# Altium project NFC_Access.PrjPcb
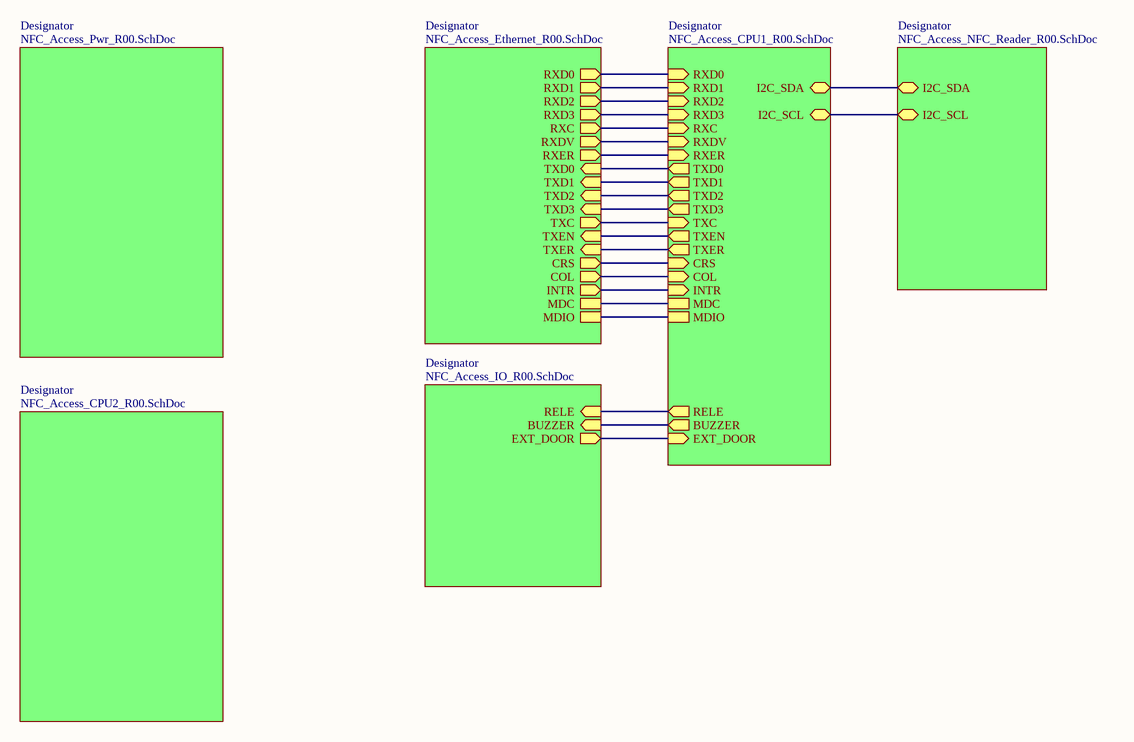
[diagram p0: NFC_Access_MainPage_R00.SchDoc]
7 sheets, 109 parts. Net scope: hierarchical (ports join the sheet entries above them; power ports are global).
Board files: NFC_Access_R00.PcbDoc, NFC_Access_Panel_R00.PcbDoc
Sheets:
  NFC_Access_MainPage_R00.SchDoc
    Designator = NFC_Access_CPU1_R00.SchDoc
    Designator = NFC_Access_Ethernet_R00.SchDoc
    Designator = NFC_Access_NFC_Reader_R00.SchDoc
    Designator = NFC_Access_IO_R00.SchDoc
    Designator = NFC_Access_Pwr_R00.SchDoc
    Designator = NFC_Access_CPU2_R00.SchDoc

## Sheet NFC_Access_MainPage_R00.SchDoc: NFC Access Board
size A4; Author: Hernan M. Travado; CompanyName: UTN FRBA; DocumentNumber: 1.0; SheetNumber: 1; SheetTotal: 7

### Sub-sheets
Designator = NFC_Access_CPU1_R00.SchDoc: CRS (in), COL (in), RXC (in), MDIO, RXDV (in), RXD2 (in), RXD3 (in), RXER (in), TXEN (out), TXD0 (out), TXD1 (out), RXD0 (in), MDC, TXC (in), TXD2 (out), RXD1 (in), TXD3 (out), INTR (in), TXER (out), RELE (out), EXT_DOOR (in), BUZZER (out), I2C_SCL (bidir), I2C_SDA (bidir)
Designator = NFC_Access_Ethernet_R00.SchDoc: RXD1 (out), RXD2 (out), RXD3 (out), RXD0 (out), RXC (out), RXDV (out), RXER (out), TXD1 (in), TXD2 (in), TXD3 (in), TXD0 (in), COL (out), CRS (out), TXC (out), TXEN (in), TXER (in), INTR (out), MDC, MDIO
Designator = NFC_Access_NFC_Reader_R00.SchDoc: I2C_SDA (bidir), I2C_SCL (bidir)
Designator = NFC_Access_IO_R00.SchDoc: RELE (in), BUZZER (in), EXT_DOOR (out)
Designator = NFC_Access_Pwr_R00.SchDoc: no entries
Designator = NFC_Access_CPU2_R00.SchDoc: no entries

### Nets
BUZZER: sheet Designator/BUZZER, sheet Designator/BUZZER
I2C_SCL: sheet Designator/I2C_SCL, sheet Designator/I2C_SCL
I2C_SDA: sheet Designator/I2C_SDA, sheet Designator/I2C_SDA
INTR: sheet Designator/INTR, sheet Designator/INTR
MDC: sheet Designator/MDC, sheet Designator/MDC
MDIO: sheet Designator/MDIO, sheet Designator/MDIO
RELE: sheet Designator/RELE, sheet Designator/RELE
TXEN: sheet Designator/TXEN, sheet Designator/TXEN
TXER: sheet Designator/TXER, sheet Designator/TXER
NetCN4_2: sheet Designator/EXT_DOOR, sheet Designator/EXT_DOOR
NetR8_2: sheet Designator/CRS, sheet Designator/CRS
NetR9_2: sheet Designator/TXC, sheet Designator/TXC
NetR10_2: sheet Designator/COL, sheet Designator/COL
NetR15_2: sheet Designator/RXD0, sheet Designator/RXD0
NetR16_2: sheet Designator/RXER, sheet Designator/RXER
NetR17_2: sheet Designator/RXD1, sheet Designator/RXD1
NetR18_2: sheet Designator/RXC, sheet Designator/RXC
NetR19_2: sheet Designator/RXD2, sheet Designator/RXD2
NetR20_2: sheet Designator/RXDV, sheet Designator/RXDV
NetR21_2: sheet Designator/RXD3, sheet Designator/RXD3
NetU4_24: sheet Designator/TXD0, sheet Designator/TXD0
NetU4_25: sheet Designator/TXD1, sheet Designator/TXD1
NetU4_26: sheet Designator/TXD2, sheet Designator/TXD2
NetU4_27: sheet Designator/TXD3, sheet Designator/TXD3

### Notes on the sheet
- Title:
- Size:
- Author:
- A4
- Sheet
- of
- Revision:
- File:
- Date:

## Sheet NFC_Access_CPU1_R00.SchDoc: NFC Access Board
size A4; Author: Hernan M. Travado; CompanyName: UTN FRBA; Revision: 1.0; SheetNumber: 5; SheetTotal: 7
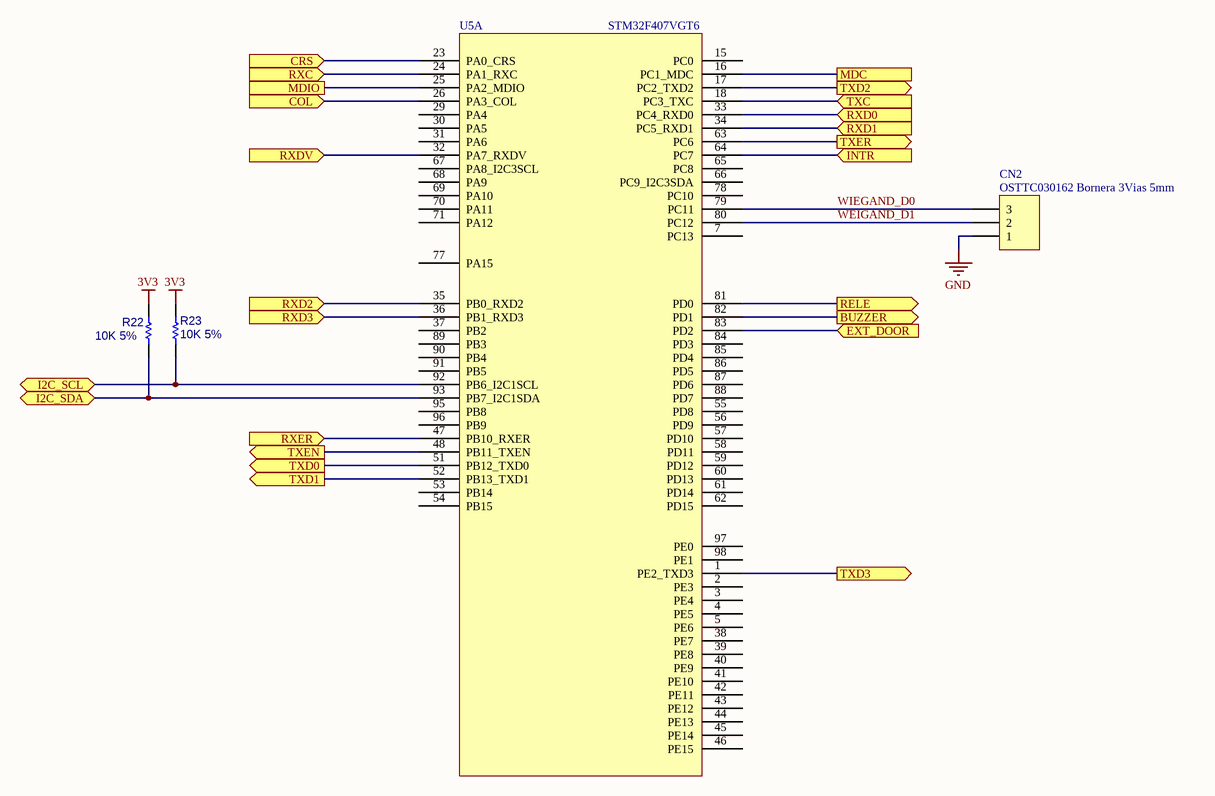
[diagram p1: NFC_Access_CPU1_R00.SchDoc]

### Parts
CN2  OSTTC030162 Bornera 3Vias 5mm  [TerminalBlock_1x3_P5mm]
R22  10K 5%  [R_0603]
R23  10K 5%  [R_0603]
U5  STM32F407VGT6  [LQFP100]  (part A of 2)

### Ports
BUZZER (out, see NFC_Access_MainPage_R00[3C], NFC_Access_IO_R00[1B]), COL (in, see NFC_Access_MainPage_R00[3B], NFC_Access_Ethernet_R00[3A]), CRS (in, see NFC_Access_MainPage_R00[3B], NFC_Access_Ethernet_R00[3A]), EXT_DOOR (in, see NFC_Access_MainPage_R00[3C], NFC_Access_IO_R00[3A]), I2C_SCL (bidir, see NFC_Access_MainPage_R00[3B], NFC_Access_NFC_Reader_R00[4B]), I2C_SDA (bidir, see NFC_Access_MainPage_R00[3B], NFC_Access_NFC_Reader_R00[4B]), INTR (in, see NFC_Access_MainPage_R00[3B], NFC_Access_Ethernet_R00[4B]), MDC (see NFC_Access_MainPage_R00[3B], NFC_Access_Ethernet_R00[4B]), MDIO (see NFC_Access_MainPage_R00[3B], NFC_Access_Ethernet_R00[4B]), RELE (out, see NFC_Access_MainPage_R00[3C], NFC_Access_IO_R00[1D]), RXC (in, see NFC_Access_MainPage_R00[3B], NFC_Access_Ethernet_R00[4D]), RXD0 (in, see NFC_Access_MainPage_R00[3A], NFC_Access_Ethernet_R00[3C]), RXD1 (in, see NFC_Access_MainPage_R00[3B], NFC_Access_Ethernet_R00[3D]), RXD2 (in, see NFC_Access_MainPage_R00[3B], NFC_Access_Ethernet_R00[3D]), RXD3 (in, see NFC_Access_MainPage_R00[3B], NFC_Access_Ethernet_R00[3D]), RXDV (in, see NFC_Access_MainPage_R00[3B], NFC_Access_Ethernet_R00[4D]), RXER (in, see NFC_Access_MainPage_R00[3B], NFC_Access_Ethernet_R00[4C]), TXC (in, see NFC_Access_MainPage_R00[3B], NFC_Access_Ethernet_R00[4A]), TXD0 (out, see NFC_Access_MainPage_R00[3B], NFC_Access_Ethernet_R00[3A]), TXD1 (out, see NFC_Access_MainPage_R00[3B], NFC_Access_Ethernet_R00[3A]), TXD2 (out, see NFC_Access_MainPage_R00[3B], NFC_Access_Ethernet_R00[3A]), TXD3 (out, see NFC_Access_MainPage_R00[3B], NFC_Access_Ethernet_R00[3A]), TXEN (out, see NFC_Access_MainPage_R00[3B], NFC_Access_Ethernet_R00[4A]), TXER (out, see NFC_Access_MainPage_R00[3B], NFC_Access_Ethernet_R00[4A])

### Nets
3V3: R22.2 R23.2
GND: CN2.1
BUZZER: U5.82(PD1) ; port BUZZER
I2C_SCL: R23.1 U5.92(PB6_I2C1SCL) ; port I2C_SCL
I2C_SDA: R22.1 U5.93(PB7_I2C1SDA) ; port I2C_SDA
INTR: U5.64(PC7) ; port INTR
MDC: U5.16(PC1_MDC) ; port MDC
MDIO: U5.25(PA2_MDIO) ; port MDIO
RELE: U5.81(PD0) ; port RELE
TXEN: U5.48(PB11_TXEN) ; port TXEN
TXER: U5.63(PC6) ; port TXER
WEIGAND_D1: CN2.2 U5.80(PC12)
WIEGAND_D0: CN2.3 U5.79(PC11)
NetCN4_2: U5.83(PD2) ; port EXT_DOOR
NetR8_2: U5.23(PA0_CRS) ; port CRS
NetR9_2: U5.18(PC3_TXC) ; port TXC
NetR10_2: U5.26(PA3_COL) ; port COL
NetR15_2: U5.33(PC4_RXD0) ; port RXD0
NetR16_2: U5.47(PB10_RXER) ; port RXER
NetR17_2: U5.34(PC5_RXD1) ; port RXD1
NetR18_2: U5.24(PA1_RXC) ; port RXC
NetR19_2: U5.35(PB0_RXD2) ; port RXD2
NetR20_2: U5.32(PA7_RXDV) ; port RXDV
NetR21_2: U5.36(PB1_RXD3) ; port RXD3
NetU4_24: U5.51(PB12_TXD0) ; port TXD0
NetU4_25: U5.52(PB13_TXD1) ; port TXD1
NetU4_26: U5.17(PC2_TXD2) ; port TXD2
NetU4_27: U5.1(PE2_TXD3) ; port TXD3

Not connected (* = marked no-connect by the designer): U5 2(PE3) 3(PE4) 4(PE5) 5(PE6) 7(PC13) 15(PC0) 29(PA4) 30(PA5) 31(PA6) 37(PB2) 38(PE7) 39(PE8) 40(PE9) 41(PE10) 42(PE11) 43(PE12) 44(PE13) 45(PE14) 46(PE15) 53(PB14) 54(PB15) 55(PD8) 56(PD9) 57(PD10) 58(PD11) 59(PD12) 60(PD13) 61(PD14) 62(PD15) 65(PC8) 66(PC9_I2C3SDA) 67(PA8_I2C3SCL) 68(PA9) 69(PA10) 70(PA11) 71(PA12) 77(PA15) 78(PC10) 84(PD3) 85(PD4) 86(PD5) 87(PD6) 88(PD7) 89(PB3) 90(PB4) 91(PB5) 95(PB8) 96(PB9) 97(PE0) 98(PE1)

### Notes on the sheet
- Title:
- Size:
- Author:
- A4
- Sheet
- of
- Revision:
- File:
- Date:

### Library data of the parts
CN2 = CONN_03P: TERM BLK 3POS SIDE ENTRY 5MM PCB / ED2601-ND
R22 R23 = Res1: Resistor / CR0603-JW-103ELFTR-ND
U5 = STM32F407: Cortex M4 32bit CPU / 497-11605-ND

## Sheet NFC_Access_Ethernet_R00.SchDoc: NFC Access Board
size A4; Author: Hernan M. Travado; CompanyName: UTN FRBA; Revision: 1.0; SheetNumber: 4; SheetTotal: 7
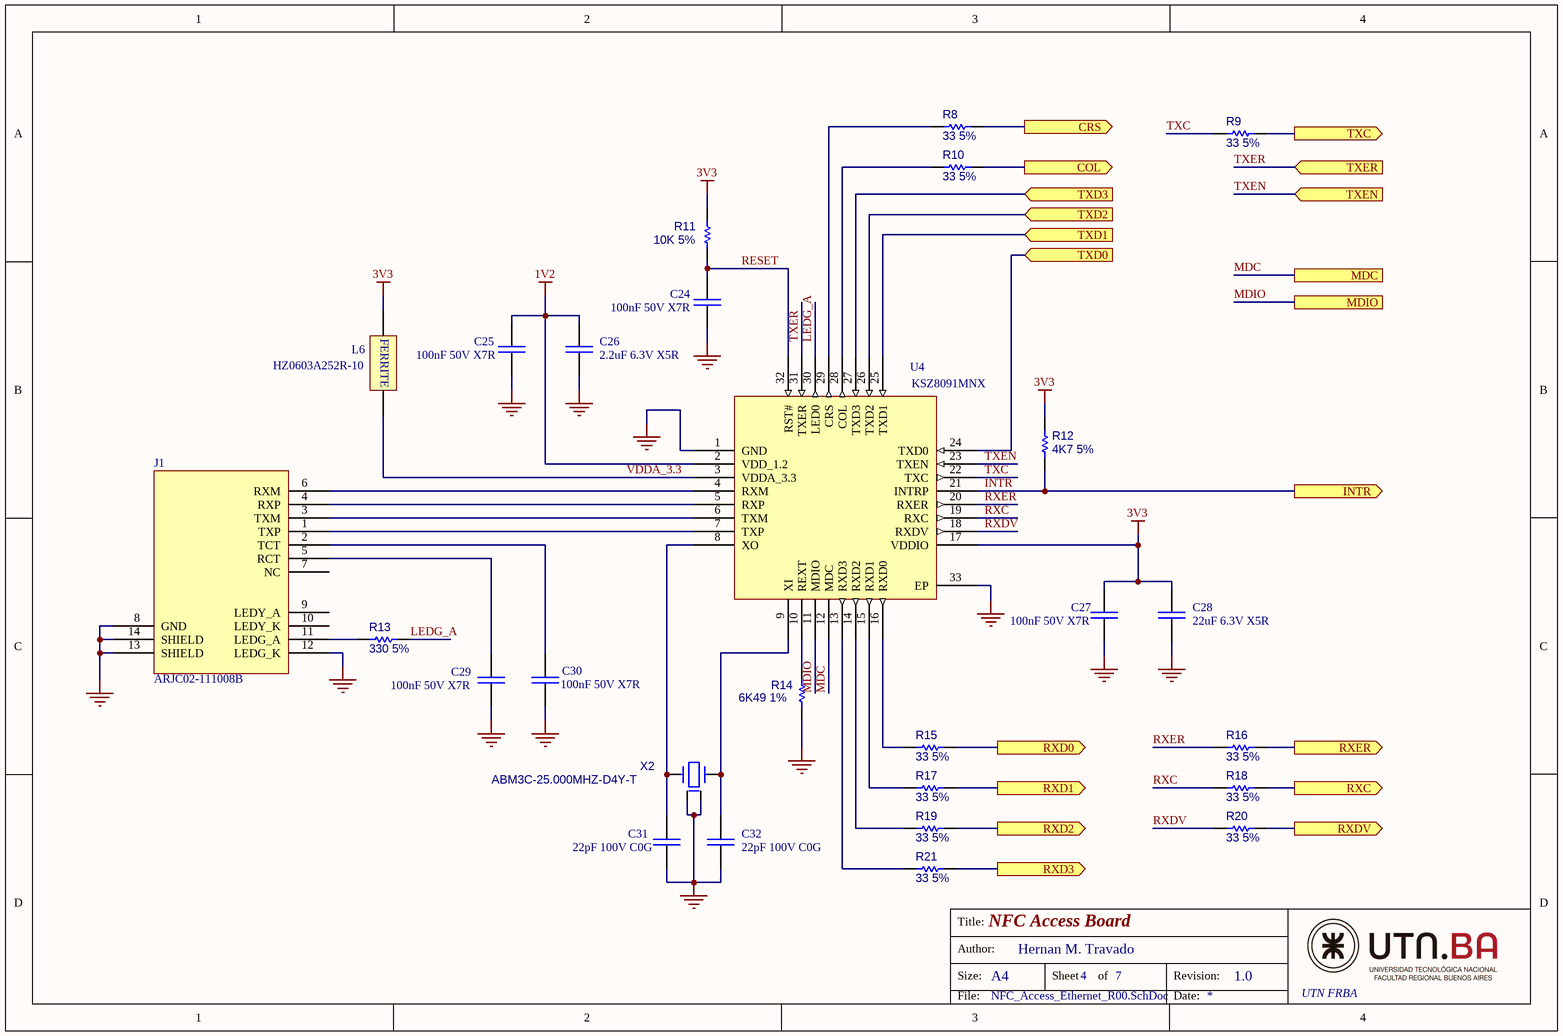
[diagram p2: NFC_Access_Ethernet_R00.SchDoc]

### Parts
C24  100nF 50V X7R  [C_0603]
C25  100nF 50V X7R  [C_0603]
C26  2.2uF 6.3V X5R  [C_0603]
C27  100nF 50V X7R  [C_0603]
C28  22uF 6.3V X5R  [C_0603]
C29  100nF 50V X7R  [C_0603]
C30  100nF 50V X7R  [C_0603]
C31  22pF 100V C0G  [C_0603]
C32  22pF 100V C0G  [C_0603]
J1  ARJC02-111008B  [ARJC02-111008B]
L6  HZ0603A252R-10  [F_0603]
R8  33 5%  [R_0603]
R9  33 5%  [R_0603]
R10  33 5%  [R_0603]
R11  10K 5%  [R_0603]
R12  4K7 5%  [R_0603]
R13  330 5%  [R_0603]
R14  6K49 1%  [R_0603]
R15  33 5%  [R_0603]
R16  33 5%  [R_0603]
R17  33 5%  [R_0603]
R18  33 5%  [R_0603]
R19  33 5%  [R_0603]
R20  33 5%  [R_0603]
R21  33 5%  [R_0603]
U4  KSZ8091MNX  [QFN32]
X2  ABM3C-25.000MHZ-D4Y-T  [ABM3C]

### Ports
COL (out, see NFC_Access_MainPage_R00[3B], NFC_Access_CPU1_R00[2A]), CRS (out, see NFC_Access_MainPage_R00[3B], NFC_Access_CPU1_R00[2A]), INTR (out, see NFC_Access_MainPage_R00[3B], NFC_Access_CPU1_R00[3A]), MDC (see NFC_Access_MainPage_R00[3B], NFC_Access_CPU1_R00[3A]), MDIO (see NFC_Access_MainPage_R00[3B], NFC_Access_CPU1_R00[2A]), RXC (out, see NFC_Access_MainPage_R00[3B], NFC_Access_CPU1_R00[2A]), RXD0 (out, see NFC_Access_MainPage_R00[3A], NFC_Access_CPU1_R00[3A]), RXD1 (out, see NFC_Access_MainPage_R00[3B], NFC_Access_CPU1_R00[3A]), RXD2 (out, see NFC_Access_MainPage_R00[3B], NFC_Access_CPU1_R00[2B]), RXD3 (out, see NFC_Access_MainPage_R00[3B], NFC_Access_CPU1_R00[2B]), RXDV (out, see NFC_Access_MainPage_R00[3B], NFC_Access_CPU1_R00[2A]), RXER (out, see NFC_Access_MainPage_R00[3B], NFC_Access_CPU1_R00[2C]), TXC (out, see NFC_Access_MainPage_R00[3B], NFC_Access_CPU1_R00[3A]), TXD0 (in, see NFC_Access_MainPage_R00[3B], NFC_Access_CPU1_R00[2C]), TXD1 (in, see NFC_Access_MainPage_R00[3B], NFC_Access_CPU1_R00[2C]), TXD2 (in, see NFC_Access_MainPage_R00[3B], NFC_Access_CPU1_R00[3A]), TXD3 (in, see NFC_Access_MainPage_R00[3B], NFC_Access_CPU1_R00[3C]), TXEN (in, see NFC_Access_MainPage_R00[3B], NFC_Access_CPU1_R00[2C]), TXER (in, see NFC_Access_MainPage_R00[3B], NFC_Access_CPU1_R00[3A])

### Nets
1V2: C25.1 C26.1 U4.2(VDD_1.2)
3V3: C27.1 C28.1 L6.1 R11.1 R12.1 U4.17(VDDIO)
GND: C24.2 C25.2 C26.2 C27.2 C28.2 C29.2 C30.2 C31.2 C32.2 J1.8(GND) J1.12(LEDG_K) J1.13(SHIELD) J1.14(SHIELD) R14.2 U4.1(GND) U4.33(EP) X2.2 X2.4
INTR: R12.2 U4.21(INTRP) ; port INTR
LEDG_A: R13.1 U4.30(LED0)
MDC: U4.12(MDC) ; port MDC
MDIO: U4.11(MDIO) ; port MDIO
RESET: C24.1 R11.2 U4.32(RST#)
RXC: R18.1 U4.19(RXC)
RXDV: R20.1 U4.18(RXDV)
RXER: R16.1 U4.20(RXER)
TXC: R9.1 U4.22(TXC)
TXEN: U4.23(TXEN) ; port TXEN
TXER: U4.31(TXER) ; port TXER
VDDA_3.3: L6.2 U4.3(VDDA_3.3)
NetC29_1: C29.1 J1.5(RCT)
NetC30_1: C30.1 J1.2(TCT)
NetC31_1: C31.1 U4.8(XO) X2.3
NetC32_1: C32.1 U4.9(XI) X2.1
NetJ1_1: J1.1(TXP) U4.7(TXP)
NetJ1_3: J1.3(TXM) U4.6(TXM)
NetJ1_4: J1.4(RXP) U4.5(RXP)
NetJ1_6: J1.6(RXM) U4.4(RXM)
NetJ1_11: J1.11(LEDG_A) R13.2
NetR8_1: R8.1 U4.29(CRS)
NetR8_2: R8.2 ; port CRS
NetR9_2: R9.2 ; port TXC
NetR10_1: R10.1 U4.28(COL)
NetR10_2: R10.2 ; port COL
NetR14_1: R14.1 U4.10(REXT)
NetR15_1: R15.1 U4.16(RXD0)
NetR15_2: R15.2 ; port RXD0
NetR16_2: R16.2 ; port RXER
NetR17_1: R17.1 U4.15(RXD1)
NetR17_2: R17.2 ; port RXD1
NetR18_2: R18.2 ; port RXC
NetR19_1: R19.1 U4.14(RXD2)
NetR19_2: R19.2 ; port RXD2
NetR20_2: R20.2 ; port RXDV
NetR21_1: R21.1 U4.13(RXD3)
NetR21_2: R21.2 ; port RXD3
NetU4_24: U4.24(TXD0) ; port TXD0
NetU4_25: U4.25(TXD1) ; port TXD1
NetU4_26: U4.26(TXD2) ; port TXD2
NetU4_27: U4.27(TXD3) ; port TXD3

Not connected (* = marked no-connect by the designer): J1 7(NC) 9(LEDY_A) 10(LEDY_K)

### Notes on the sheet
- Title:
- Size:
- Author:
- A4
- Sheet
- of
- Revision:
- File:
- Date:

### Library data of the parts
C24 C25 C27 C29 C30 = Ceramic capacitor: Ceramic Capacitor / 1276-1018-2-ND
C26 = Ceramic capacitor: Ceramic Capacitor / 1276-1183-2-ND
C28 = Ceramic capacitor: Ceramic Capacitor / 1276-1193-2-ND
C31 C32 = Ceramic capacitor: Ceramic Capacitor / 490-4942-2-ND
J1 = SI-46001-F: RJ45 with Magentics / 535-12605-ND
L6 = FERRITE: Ferrite Bead / 240-2561-2-ND
R8-R10 R15-R21 = Res1: Resistor / 118-CR0603-JW-330ELFTR-ND
R11 = Res1: Resistor / CR0603-JW-103ELFTR-ND
R12 = Res1: Resistor / CR0603-JW-472ELFTR-ND
R13 = Res1: Resistor / CR0603-JW-331ELFTR-ND
R14 = Res1: Resistor / CR0603-FX-6491ELFTR-ND
U4 = KSZ8091MNX: IC TRANSCEIVER FULL 1/1 32QFN / KSZ8091MNXIA-TR-ND
X2 = CRYSTAL_4P: Crystal 4 Vias + GND 25.00MHz / 535-11296-2-ND

## Sheet NFC_Access_NFC_Reader_R00.SchDoc: NFC Access Board
size A4; Author: Hernan M. Travado; CompanyName: UTN FRBA; Revision: 1.0; SheetNumber: 3; SheetTotal: 7
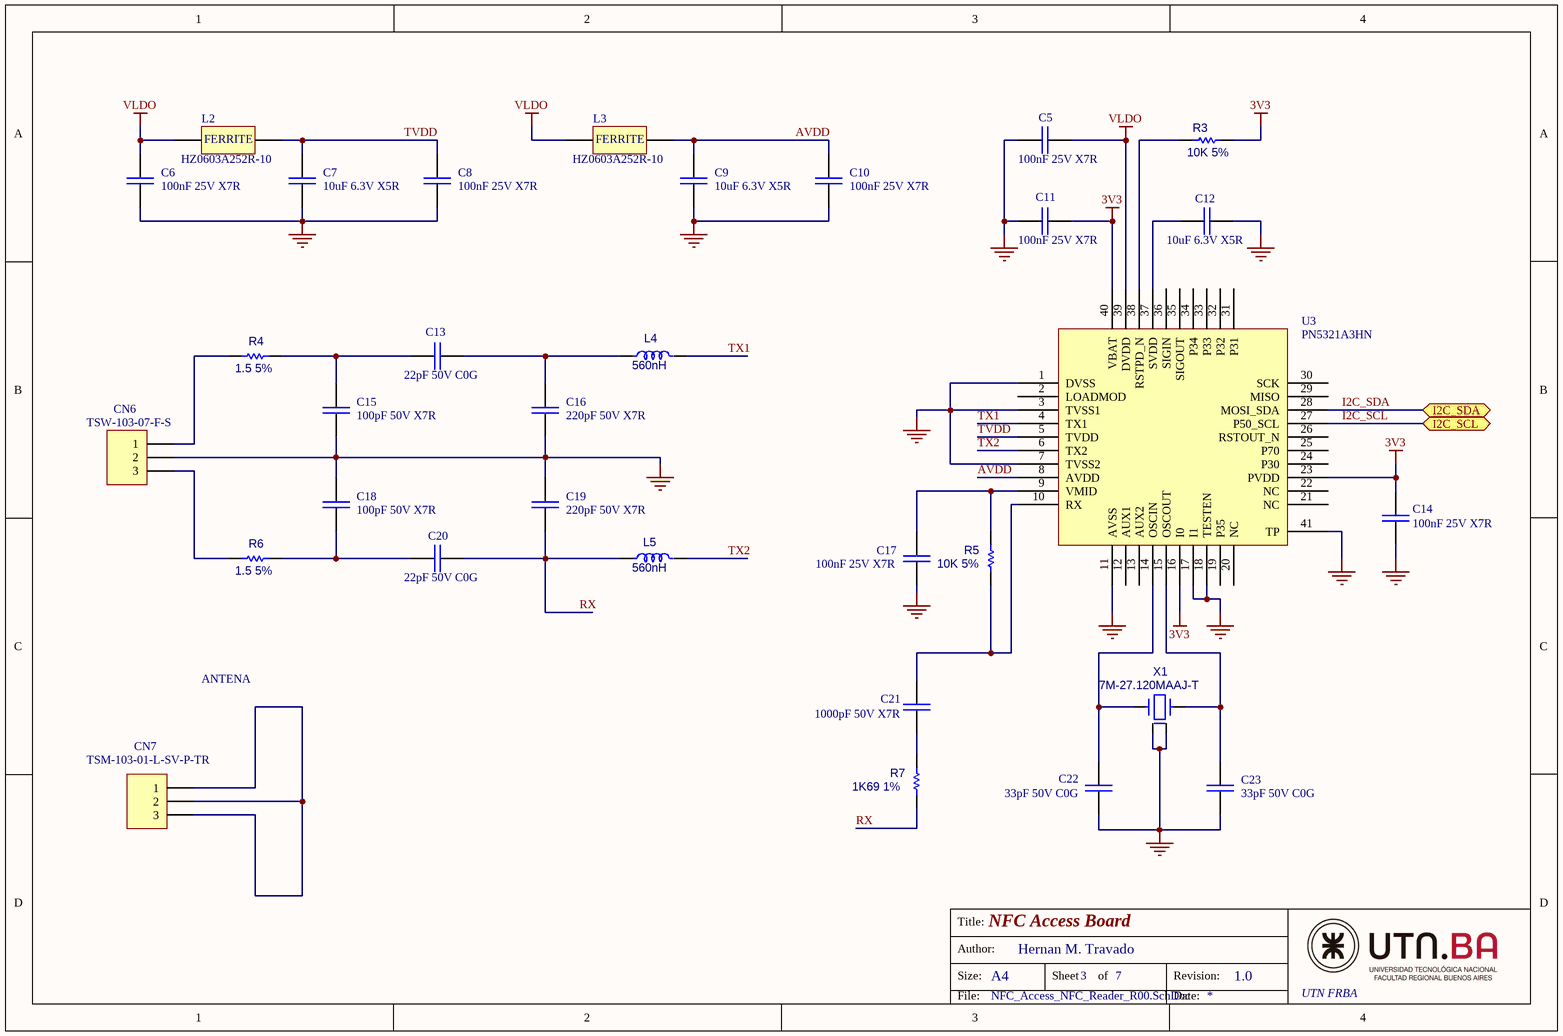
[diagram p3: NFC_Access_NFC_Reader_R00.SchDoc]

### Parts
C5  100nF 25V X7R  [C_0603]
C6  100nF 25V X7R  [C_0603]
C7  10uF 6.3V X5R  [C_0603]
C8  100nF 25V X7R  [C_0603]
C9  10uF 6.3V X5R  [C_0603]
C10  100nF 25V X7R  [C_0603]
C11  100nF 25V X7R  [C_0603]
C12  10uF 6.3V X5R  [C_0603]
C13  22pF 50V C0G  [C_0603]
C14  100nF 25V X7R  [C_0603]
C15  100pF 50V X7R  [C_0603]
C16  220pF 50V X7R  [C_0603]
C17  100nF 25V X7R  [C_0603]
C18  100pF 50V X7R  [C_0603]
C19  220pF 50V X7R  [C_0603]
C20  22pF 50V C0G  [C_0603]
C21  1000pF 50V X7R  [C_0603]
C22  33pF 50V C0G  [C_0603]
C23  33pF 50V C0G  [C_0603]
CN6  TSW-103-07-F-S  [Header_M_1x3_0.1]
CN7  TSM-103-01-L-SV-P-TR  [HEADER_M_1x3_0.1"_SMD]
L2  HZ0603A252R-10  [F_0603]
L3  HZ0603A252R-10  [F_0603]
L4  560nH  [I_0603]
L5  560nH  [I_0603]
R3  10K 5%  [R_0603]
R4  1.5 5%  [R_0603]
R5  10K 5%  [R_0603]
R6  1.5 5%  [R_0603]
R7  1K69 1%  [R_0603]
U3  PN5321A3HN  [QFN40G-0.5-6X6MM]
X1  7M-27.120MAAJ-T  [7M-4-SMD]

### Ports
I2C_SCL (bidir, see NFC_Access_MainPage_R00[3B], NFC_Access_CPU1_R00[1B]), I2C_SDA (bidir, see NFC_Access_MainPage_R00[3B], NFC_Access_CPU1_R00[1B])

### Nets
3V3: C11.1 C14.1 R3.1 U3.16(I0) U3.23(PVDD) U3.40(VBAT)
GND: C5.2 C6.2 C7.1 C8.2 C9.1 C10.2 C11.2 C12.2 C14.2 C15.2 C16.2 C17.2 C18.1 C19.1 C22.2 C23.2 CN6.2 U3.1(DVSS) U3.3(TVSS1) U3.7(TVSS2) U3.11(AVSS) U3.17(I1) U3.18(TESTEN) U3.41(TP) X1.2 X1.4
VLDO: C5.1 C6.1 L2.1 L3.1 U3.39(DVDD)
AVDD: C9.2 C10.1 L3.2 U3.8(AVDD)
I2C_SCL: U3.27(P50_SCL) ; port I2C_SCL
I2C_SDA: U3.28(MOSI_SDA) ; port I2C_SDA
RX: C19.2 C20.2 L5.1 R7.2
TVDD: C7.2 C8.1 L2.2 U3.5(TVDD)
TX1: L4.2 U3.4(TX1)
TX2: L5.2 U3.6(TX2)
NetC12_1: C12.1 U3.37(SVDD)
NetC13_1: C13.1 C15.1 R4.2
NetC13_2: C13.2 C16.1 L4.1
NetC17_1: C17.1 R5.1 U3.9(VMID)
NetC18_2: C18.2 C20.1 R6.2
NetC21_1: C21.1 R5.2 U3.10(RX)
NetC21_2: C21.2 R7.1
NetC22_1: C22.1 U3.14(OSCIN) X1.3
NetC23_1: C23.1 U3.15(OSCOUT) X1.1
NetCN6_1: CN6.1 R4.1
NetCN6_3: CN6.3 R6.1
NetCN7_1: CN7.1 CN7.2 CN7.3
NetR3_2: R3.2 U3.38(RSTPD_N)

Not connected (* = marked no-connect by the designer): U3 2(LOADMOD) 12(AUX1) 13(AUX2) 19(P35) 20(NC) 21(NC) 22(NC) 24(P30) 25(P70) 26(RSTOUT_N) 29(MISO) 30(SCK) 31(P31) 32(P32) 33(P33) 34(P34) 35(SIGOUT) 36(SIGIN)

### Notes on the sheet
- ANTENA
- Title:
- Size:
- Author:
- A4
- Sheet
- of
- Revision:
- File:
- Date:

### Library data of the parts
C5 C6 C8 C10 C11 C14 C17 C21 = Ceramic capacitor: Ceramic Capacitor / 1276-1018-2-ND
C7 C9 C12 = Ceramic capacitor: Ceramic Capacitor / 1276-1119-2-ND
C13 C20 = Ceramic capacitor: Ceramic Capacitor / 1276-2228-2-ND
C15 C18 = Ceramic capacitor: Ceramic Capacitor / 1276-1908-2-ND
C16 C19 = Ceramic capacitor: Ceramic Capacitor / 1276-1986-2-ND
C22 C23 = Ceramic capacitor: Ceramic Capacitor / 1276-1070-2-ND
CN6 = CONN_03P: CONN HEADER VERT 3POS 2.54MM / SAM8995-ND
CN7 = CONN_03P: CONN HEADER SMD 3POS 2.54MM / SAM13281TR-ND
L2 L3 = FERRITE: Ferrite Bead / 240-2561-2-ND
L4 L5 = IND: FIXED IND 560NH 450MA 480MOHM SM / 490-LQW18CNR56J0ZDTR-ND
R3 R5 = Res1: Resistor / CR0603-JW-103ELFTR-ND
R4 R6 = Res1: Resistor SMD 0603 / CR0603-J/-1R5ELFTR-ND
R7 = Res1: Resistor / CR0603-FX-1691ELFTR-ND
U3 = PN532: NFC Controller / 568-13228-ND
X1 = CRYSTAL_4P: Crystal 4 Vias + GND 27.12 MHz / 887-1424-2-ND

## Sheet NFC_Access_IO_R00.SchDoc: NFC Access Board
size A4; Author: Hernan M. Travado; CompanyName: UTN FRBA; Revision: 1.0; SheetNumber: 7; SheetTotal: 7
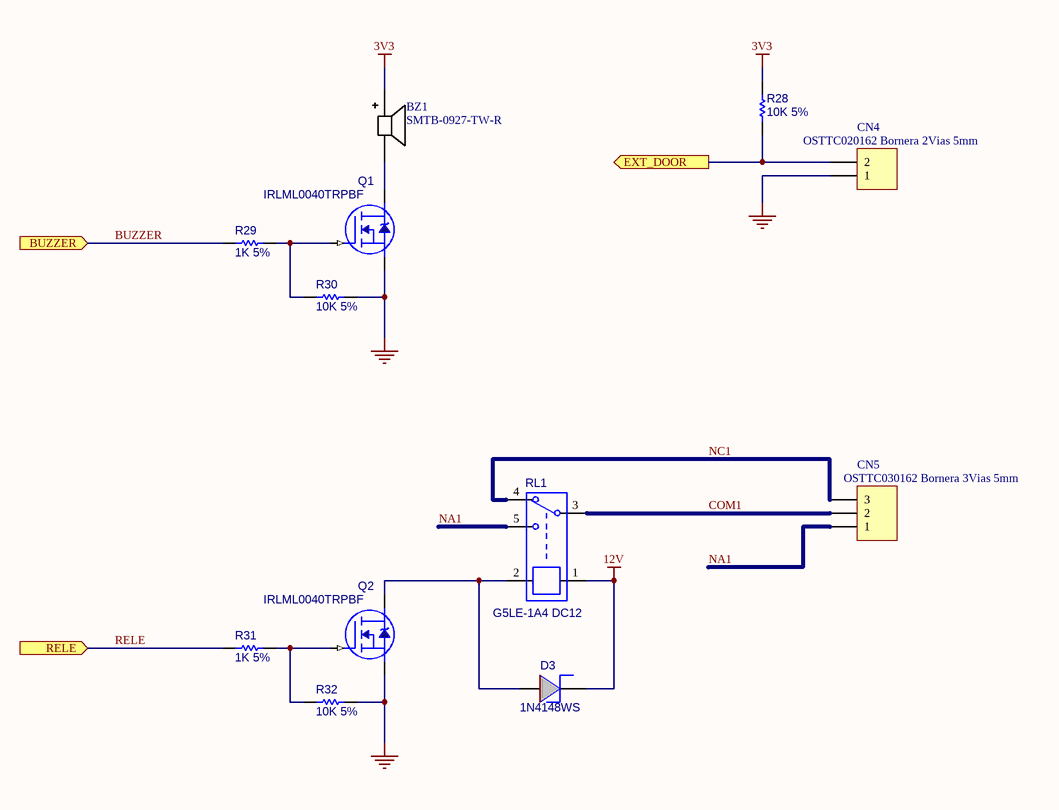
[diagram p4: NFC_Access_IO_R00.SchDoc]

### Parts
BZ1  SMTB-0927-TW-R  [SMTB-0927-TW-R]
CN4  OSTTC020162 Bornera 2Vias 5mm  [TerminalBlock_1x2_P5mm]
CN5  OSTTC030162 Bornera 3Vias 5mm  [TerminalBlock_1x3_P5mm]
D3  1N4148WS  [SOD_323]
Q1  IRLML0040TRPBF  [SOT_23]
Q2  IRLML0040TRPBF  [SOT_23]
R28  10K 5%  [R_0603]
R29  1K 5%  [R_0603]
R30  10K 5%  [R_0603]
R31  1K 5%  [R_0603]
R32  10K 5%  [R_0603]
RL1  G5LE-1A4 DC12  [G5LE-1]

### Ports
BUZZER (in, see NFC_Access_MainPage_R00[3C], NFC_Access_CPU1_R00[3B]), EXT_DOOR (out, see NFC_Access_MainPage_R00[3C], NFC_Access_CPU1_R00[3B]), RELE (in, see NFC_Access_MainPage_R00[3C], NFC_Access_CPU1_R00[3B])

### Nets
3V3: BZ1.1 R28.2
12V: D3.2(K) RL1.1
GND: CN4.1 Q1.2(SOURCE) Q2.2(SOURCE) R30.1 R32.1
BUZZER: R29.2 ; port BUZZER
COM1: CN5.2 RL1.3
NA1: CN5.1 RL1.5
NC1: CN5.3 RL1.4
RELE: R31.2 ; port RELE
NetBZ1_2: BZ1.2 Q1.3(DRAIN)
NetCN4_2: CN4.2 R28.1 ; port EXT_DOOR
NetD3_1: D3.1(A) Q2.3(DRAIN) RL1.2
NetQ1_1: Q1.1(GATE) R29.1 R30.2
NetQ2_1: Q2.1(GATE) R31.1 R32.2

### Notes on the sheet
- Title:
- Size:
- Author:
- A4
- Sheet
- of
- Revision:
- File:
- Date:

### Library data of the parts
BZ1 = Buzzer: 3V3 Active Buzzer / 668-SMTB-0927-TW-RTR-ND
CN4 = CONN_02P: TERM BLK 2POS SIDE ENTRY 5MM PCB / ED2600-ND
CN5 = CONN_03P: as CN2 on sheet NFC_Access_CPU1_R00
D3 = DIODO_SH: DIODE GEN PURP 75V 300MA SOD323 / 1655-1N4148WSTR-ND
Q1 Q2 = N_MOSFET_SOT23: Mosfet N-Ch / IRLML0040TRPBFTR-ND
R28 R30 R32 = Res1: Resistor / CR0603-JW-103ELFTR-ND
R29 R31 = Res1: Resistor / CR0603-JW-102ELFTR-ND
RL1 = RELAY SPDT: RELAY GEN PURPOSE SPST 10A 12V / Z2352-ND

## Sheet NFC_Access_Pwr_R00.SchDoc: NFC Access Board
size A4; Author: Hernan M. Travado; CompanyName: UTN FRBA; Revision: 1.0; SheetNumber: 2; SheetTotal: 7
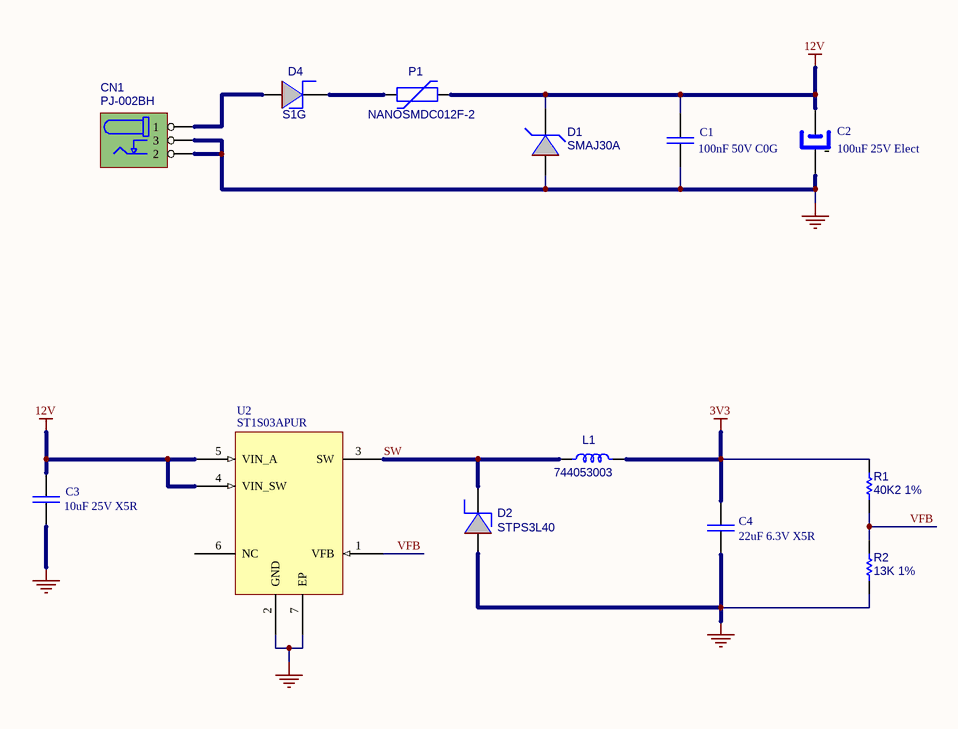
[diagram p5: NFC_Access_Pwr_R00.SchDoc]

### Parts
C1  100nF 50V C0G  [C_1206]
C2  100uF 25V Elect  [CAP_ELECT_6.3_7.7]
C3  10uF 25V X5R  [C_1206]
C4  22uF 6.3V X5R  [C_1206]
CN1  PJ-002BH  [PJ002B]
D1  SMAJ30A  [D_SMA]
D2  STPS3L40  [D_214]
D4  S1G  [D_SMA]
L1  744053003  [744053003]
P1  NANOSMDC012F-2  [NANOSMDC]
R1  40K2 1%  [R_0603]
R2  13K 1%  [R_0603]
U2  ST1S03APUR  [6-VDFN]

### Nets
3V3: C4.1 L1.2 R1.2
12V: C1.1 C2.1 C3.1 D1.2(K) P1.2 U2.4(VIN_SW) U2.5(VIN_A)
GND: C1.2 C2.2 C3.2 C4.2 CN1.2 CN1.3 D1.1(A) D2.1(A) R2.1 U2.2(GND) U2.7(EP)
SW: D2.2(K) L1.1 U2.3(SW)
VFB: R1.1 R2.2 U2.1(VFB)
NetCN1_1: CN1.1 D4.1(A)
NetD4_2: D4.2(K) P1.1

Not connected (* = marked no-connect by the designer): U2 6(NC)

### Notes on the sheet
- Title:
- Size:
- Author:
- A4
- Sheet
- of
- Revision:
- File:
- Date:

### Library data of the parts
C1 = Ceramic capacitor: Ceramic Capacitor / MNF: GRM31C5C1H104JA01L / DGK: 490-6505-2-ND
C2 = Pol capacitor: Polarized Capacitor / 732-8438-2-ND
C3 = Ceramic capacitor: Ceramic Capacitor / MNF:GRM31CR61E106KA12L / DGK:490-3373-2-ND
C4 = Ceramic capacitor: Ceramic Capacitor / MNF: GRM31CR60J226KE19L / DGK: 490-1824-2-ND
CN1 = CN_PowerJack: Barrel Power Connector / CP-002BH-ND
D1 = DIODE_TVS: Unidirectional TVS / SMAJ30ABTR-ND
D2 = DIODO_SH: Diode Shottky / 497-4673-2-ND
D4 = DIODO_SH: Diode Shottky / 1655-S1GTR-ND
L1 = IND: FIXED IND 3UH 2.8A 30 MOHM SMD / 732-1037-2-ND
P1 = PLYSW: Polyswitch / NANOSMDC012F-2TR-ND
R1 = Res1: Resistor / CR0603-FX-4022ELFTR-ND
R2 = Res1: Resistor / CR0603-FX-1302ELFTR-ND
U2 = ST1S03: IC REG BUCK ADJUSTABLE 1.5A / 497-6902-2-ND

## Sheet NFC_Access_CPU2_R00.SchDoc: NFC Access Board
size A4; Author: Hernan M. Travado; CompanyName: UTN FRBA; Revision: 1.0; SheetNumber: 6; SheetTotal: 7
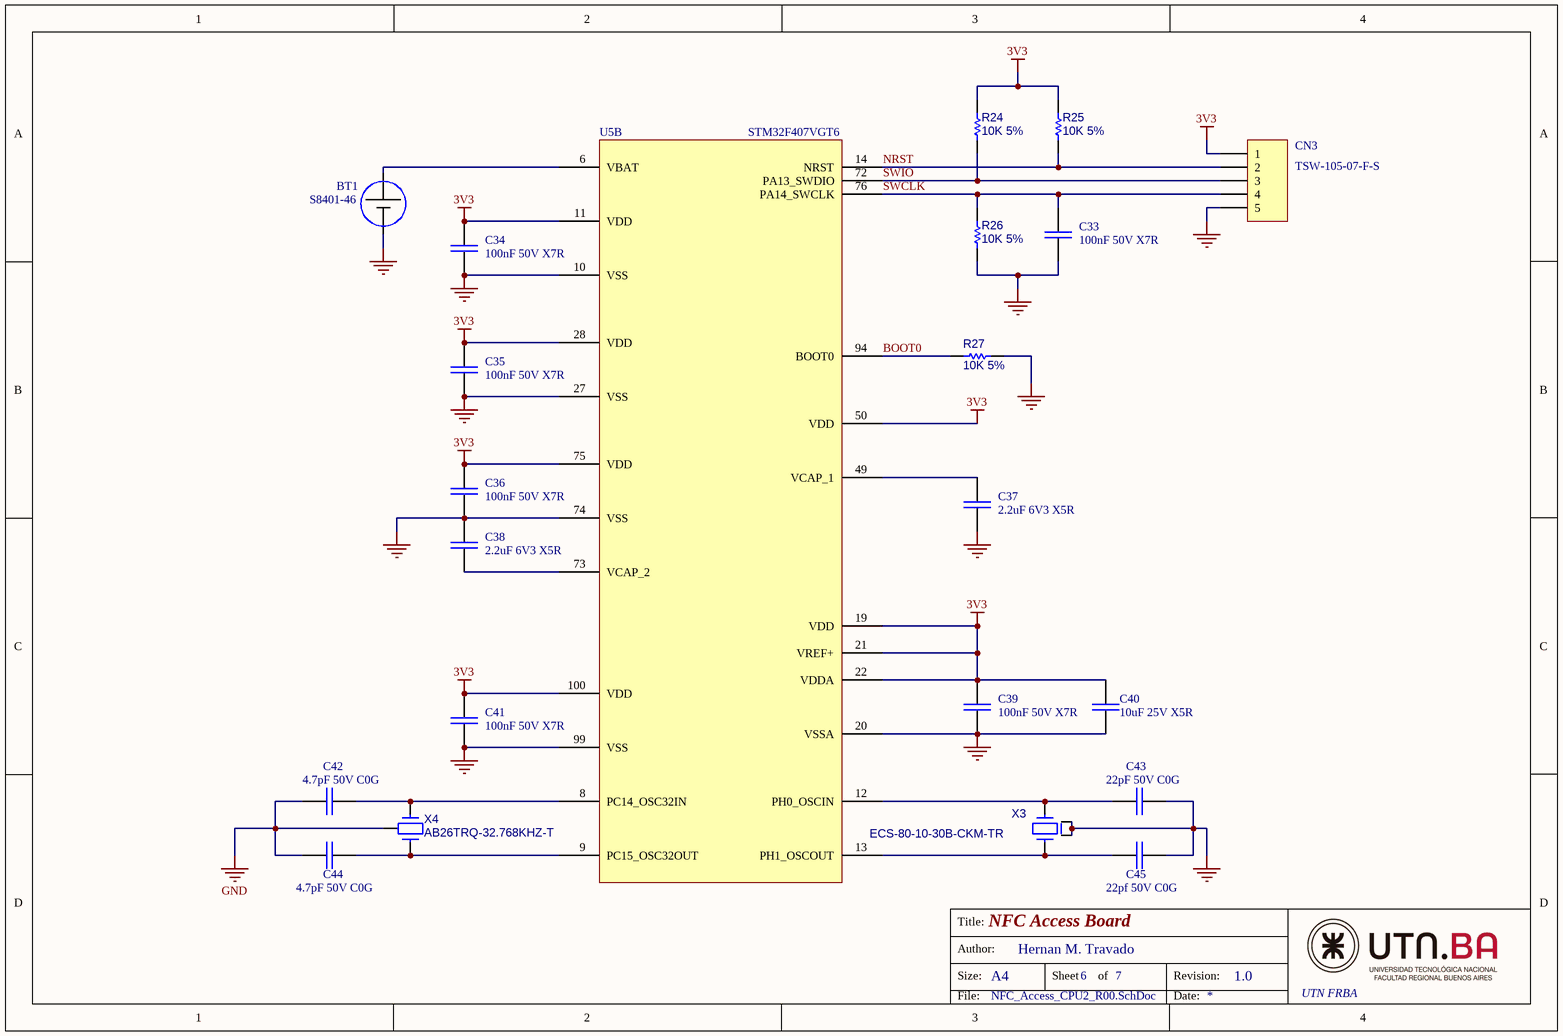
[diagram p6: NFC_Access_CPU2_R00.SchDoc]

### Parts
BT1  S8401-46  [S8401-46]
C33  100nF 50V X7R  [C_0603]
C34  100nF 50V X7R  [C_0603]
C35  100nF 50V X7R  [C_0603]
C36  100nF 50V X7R  [C_0603]
C37  2.2uF 6V3 X5R  [C_0603]
C38  2.2uF 6V3 X5R  [C_0603]
C39  100nF 50V X7R  [C_0603]
C40  10uF 25V X5R  [C_0603]
C41  100nF 50V X7R  [C_0603]
C42  4.7pF 50V C0G  [C_0603]
C43  22pF 50V C0G  [C_0603]
C44  4.7pF 50V C0G  [C_0603]
C45  22pf 50V C0G  [C_0603]
CN3  TSW-105-07-F-S  [Header_M_1x5_0.1"]
R24  10K 5%  [R_0603]
R25  10K 5%  [R_0603]
R26  10K 5%  [R_0603]
R27  10K 5%  [R_0603]
U5  STM32F407VGT6  [LQFP100]  (part B of 2)
X3  ECS-80-10-30B-CKM-TR  [ABM3C]
X4  AB26TRQ-32.768KHZ-T  [AB26TQF]

### Nets
3V3: C34.1 C35.1 C36.1 C39.2 C40.1 C41.1 CN3.1 R24.1 R25.1 U5.11(VDD) U5.19(VDD) U5.21(VREF+) U5.22(VDDA) U5.28(VDD) U5.50(VDD) U5.75(VDD) U5.100(VDD)
GND: BT1.1(V-) C33.2 C34.2 C35.2 C36.2 C37.2 C38.2 C39.1 C40.2 C41.2 C42.2 C43.2 C44.2 C45.2 CN3.5 R26.2 R27.1 U5.10(VSS) U5.20(VSSA) U5.27(VSS) U5.74(VSS) U5.99(VSS) X3.2 X3.4 X4.3
BOOT0: R27.2 U5.94(BOOT0)
NRST: CN3.2 R25.2 U5.14(NRST)
SWCLK: C33.1 CN3.4 R26.1 U5.76(PA14_SWCLK)
SWIO: CN3.3 R24.2 U5.72(PA13_SWDIO)
NetBT1_2: BT1.2(V+) U5.6(VBAT)
NetC37_1: C37.1 U5.49(VCAP_1)
NetC38_1: C38.1 U5.73(VCAP_2)
NetC42_1: C42.1 U5.8(PC14_OSC32IN) X4.2
NetC43_1: C43.1 U5.12(PH0_OSCIN) X3.1
NetC44_1: C44.1 U5.9(PC15_OSC32OUT) X4.1
NetC45_1: C45.1 U5.13(PH1_OSCOUT) X3.3

### Notes on the sheet
- Title:
- Size:
- Author:
- A4
- Sheet
- of
- Revision:
- File:
- Date:

### Library data of the parts
BT1 = CR2032: BATT HLDR COIN 20MM 1 CEL PC PIN / 952-1743-2-ND
C33-C36 C39 C41 = Ceramic capacitor: Ceramic Capacitor / 1276-1018-2-ND
C37 C38 = Ceramic capacitor: Ceramic Capacitor / 1276-1183-2-ND
C40 = Ceramic capacitor: Ceramic Capacitor / MNF:GRM31CR61E106KA12L / DGK:1276-1869-2-ND
C42 C44 = Ceramic capacitor: Ceramic Capacitor / 1276-1792-2-ND
C43 C45 = Ceramic capacitor: Ceramic Capacitor / 1276-2228-2-ND
CN3 = CONN_05P: CONN HEADER VERT 5POS 2.54MM / SAM10336-ND
R24-R27 = Res1: Resistor / CR0603-JW-103ELFTR-ND
U5 = STM32F407: Cortex M4 32bit CPU / 497-11605-ND
X3 = CRYSTAL_4P: Crystal 4 Vias + GND 8 MHz / 50-ECS-80-10-30B-CKM-TR-ND
X4 = CRYSTAL 3P: Crystal 2 Vias + GND 32.768 kHz / 535-12051-2-ND

## Nets that join several sheets
3V3: NFC_Access_CPU1_R00 (R22.2 R23.2), NFC_Access_Ethernet_R00 (6 pins), NFC_Access_NFC_Reader_R00 (6 pins), NFC_Access_IO_R00 (BZ1.1 R28.2), NFC_Access_Pwr_R00 (C4.1 L1.2 R1.2), NFC_Access_CPU2_R00 (17 pins)
12V: NFC_Access_IO_R00 (D3.2 RL1.1), NFC_Access_Pwr_R00 (7 pins)
GND: NFC_Access_CPU1_R00 (CN2.1), NFC_Access_Ethernet_R00 (18 pins), NFC_Access_NFC_Reader_R00 (26 pins), NFC_Access_IO_R00 (5 pins), NFC_Access_Pwr_R00 (11 pins), NFC_Access_CPU2_R00 (25 pins)
BUZZER: NFC_Access_CPU1_R00 (U5.82), NFC_Access_IO_R00 (R29.2)
I2C_SCL: NFC_Access_CPU1_R00 (R23.1 U5.92), NFC_Access_NFC_Reader_R00 (U3.27)
I2C_SDA: NFC_Access_CPU1_R00 (R22.1 U5.93), NFC_Access_NFC_Reader_R00 (U3.28)
INTR: NFC_Access_CPU1_R00 (U5.64), NFC_Access_Ethernet_R00 (R12.2 U4.21)
MDC: NFC_Access_CPU1_R00 (U5.16), NFC_Access_Ethernet_R00 (U4.12)
MDIO: NFC_Access_CPU1_R00 (U5.25), NFC_Access_Ethernet_R00 (U4.11)
NetCN4_2: NFC_Access_CPU1_R00 (U5.83), NFC_Access_IO_R00 (CN4.2 R28.1)
NetR8_2: NFC_Access_CPU1_R00 (U5.23), NFC_Access_Ethernet_R00 (R8.2)
NetR9_2: NFC_Access_CPU1_R00 (U5.18), NFC_Access_Ethernet_R00 (R9.2)
NetR10_2: NFC_Access_CPU1_R00 (U5.26), NFC_Access_Ethernet_R00 (R10.2)
NetR15_2: NFC_Access_CPU1_R00 (U5.33), NFC_Access_Ethernet_R00 (R15.2)
NetR16_2: NFC_Access_CPU1_R00 (U5.47), NFC_Access_Ethernet_R00 (R16.2)
NetR17_2: NFC_Access_CPU1_R00 (U5.34), NFC_Access_Ethernet_R00 (R17.2)
NetR18_2: NFC_Access_CPU1_R00 (U5.24), NFC_Access_Ethernet_R00 (R18.2)
NetR19_2: NFC_Access_CPU1_R00 (U5.35), NFC_Access_Ethernet_R00 (R19.2)
NetR20_2: NFC_Access_CPU1_R00 (U5.32), NFC_Access_Ethernet_R00 (R20.2)
NetR21_2: NFC_Access_CPU1_R00 (U5.36), NFC_Access_Ethernet_R00 (R21.2)
NetU4_24: NFC_Access_CPU1_R00 (U5.51), NFC_Access_Ethernet_R00 (U4.24)
NetU4_25: NFC_Access_CPU1_R00 (U5.52), NFC_Access_Ethernet_R00 (U4.25)
NetU4_26: NFC_Access_CPU1_R00 (U5.17), NFC_Access_Ethernet_R00 (U4.26)
NetU4_27: NFC_Access_CPU1_R00 (U5.1), NFC_Access_Ethernet_R00 (U4.27)
RELE: NFC_Access_CPU1_R00 (U5.81), NFC_Access_IO_R00 (R31.2)
TXEN: NFC_Access_CPU1_R00 (U5.48), NFC_Access_Ethernet_R00 (U4.23)
TXER: NFC_Access_CPU1_R00 (U5.63), NFC_Access_Ethernet_R00 (U4.31)